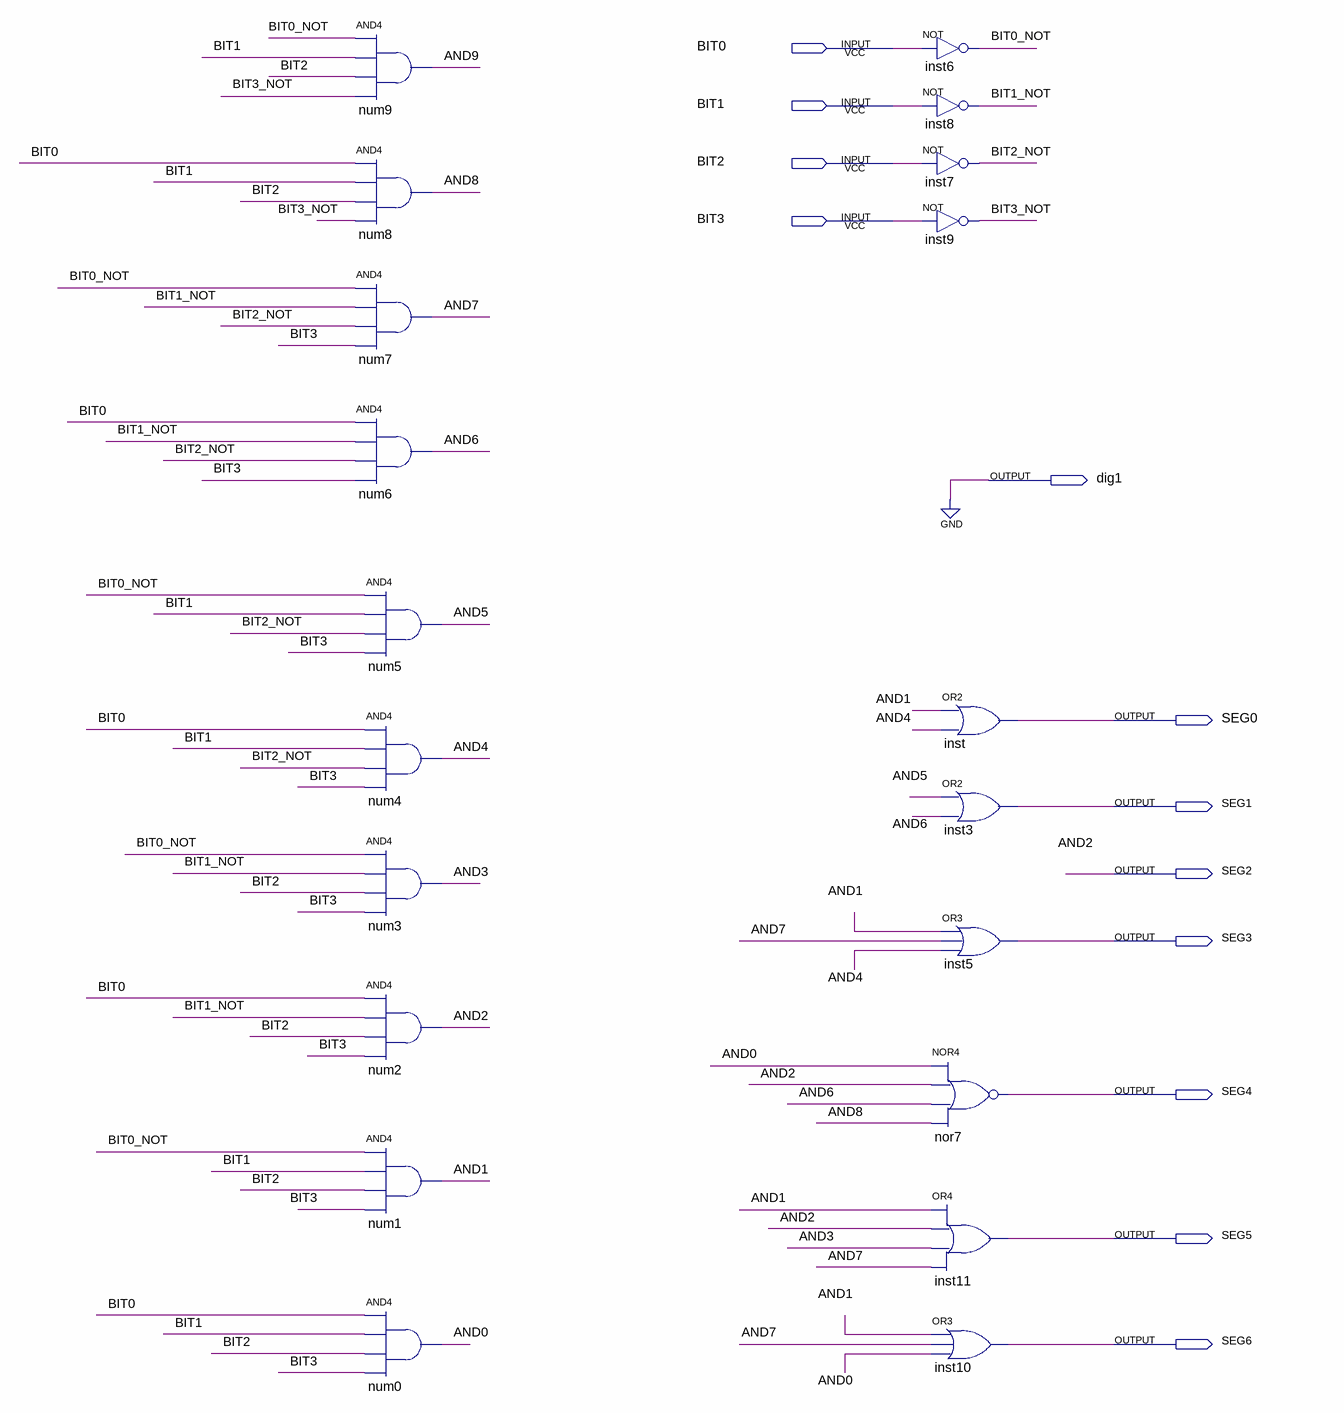
[diagram p0: schematic sheet]
// Quartus schematic d7seg.bdf as structural Verilog: 20 symbols, 12 pins
module d7seg (
  input  BIT0,
  input  BIT1,
  input  BIT2,
  input  BIT3,
  output dig1,
  output SEG0,
  output SEG1,
  output SEG2,
  output SEG3,
  output SEG4,
  output SEG5,
  output SEG6
);

  wire AND0, AND1, AND3, AND4, AND5, AND6, AND7, AND8, AND9, BIT0_NOT, BIT1_NOT, BIT2_NOT, BIT3_NOT;

  and num9 (AND9, BIT0_NOT, BIT1, BIT2, BIT3_NOT);
  and num8 (AND8, BIT0, BIT1, BIT2, BIT3_NOT);
  and num7 (AND7, BIT0_NOT, BIT1_NOT, BIT2_NOT, BIT3);
  and num6 (AND6, BIT0, BIT1_NOT, BIT2_NOT, BIT3);
  and num5 (AND5, BIT0_NOT, BIT1, BIT2_NOT, BIT3);
  and num4 (AND4, BIT0, BIT1, BIT2_NOT, BIT3);
  and num3 (AND3, BIT0_NOT, BIT1_NOT, BIT2, BIT3);
  and num2 (SEG2, BIT0, BIT1_NOT, BIT2, BIT3);
  and num1 (AND1, BIT0_NOT, BIT1, BIT2, BIT3);
  and num0 (AND0, BIT0, BIT1, BIT2, BIT3);
  not inst6 (BIT0_NOT, BIT0);
  not inst8 (BIT1_NOT, BIT1);
  not inst7 (BIT2_NOT, BIT2);
  not inst9 (BIT3_NOT, BIT3);
  or inst (SEG0, AND1, AND4);
  or inst3 (SEG1, AND5, AND6);
  or inst5 (SEG3, AND1, AND7, AND4);
  nor nor7 (SEG4, AND0, SEG2, AND6, AND8);
  or inst11 (SEG5, AND1, SEG2, AND3, AND7);
  or inst10 (SEG6, AND1, AND7, AND0);

  assign dig1 = 1'b0;

  // Other names for the same wires on the sheet: AND2 = SEG2
endmodule
